# EAGLE design gacyagacya (EAGLE 9.6.2)
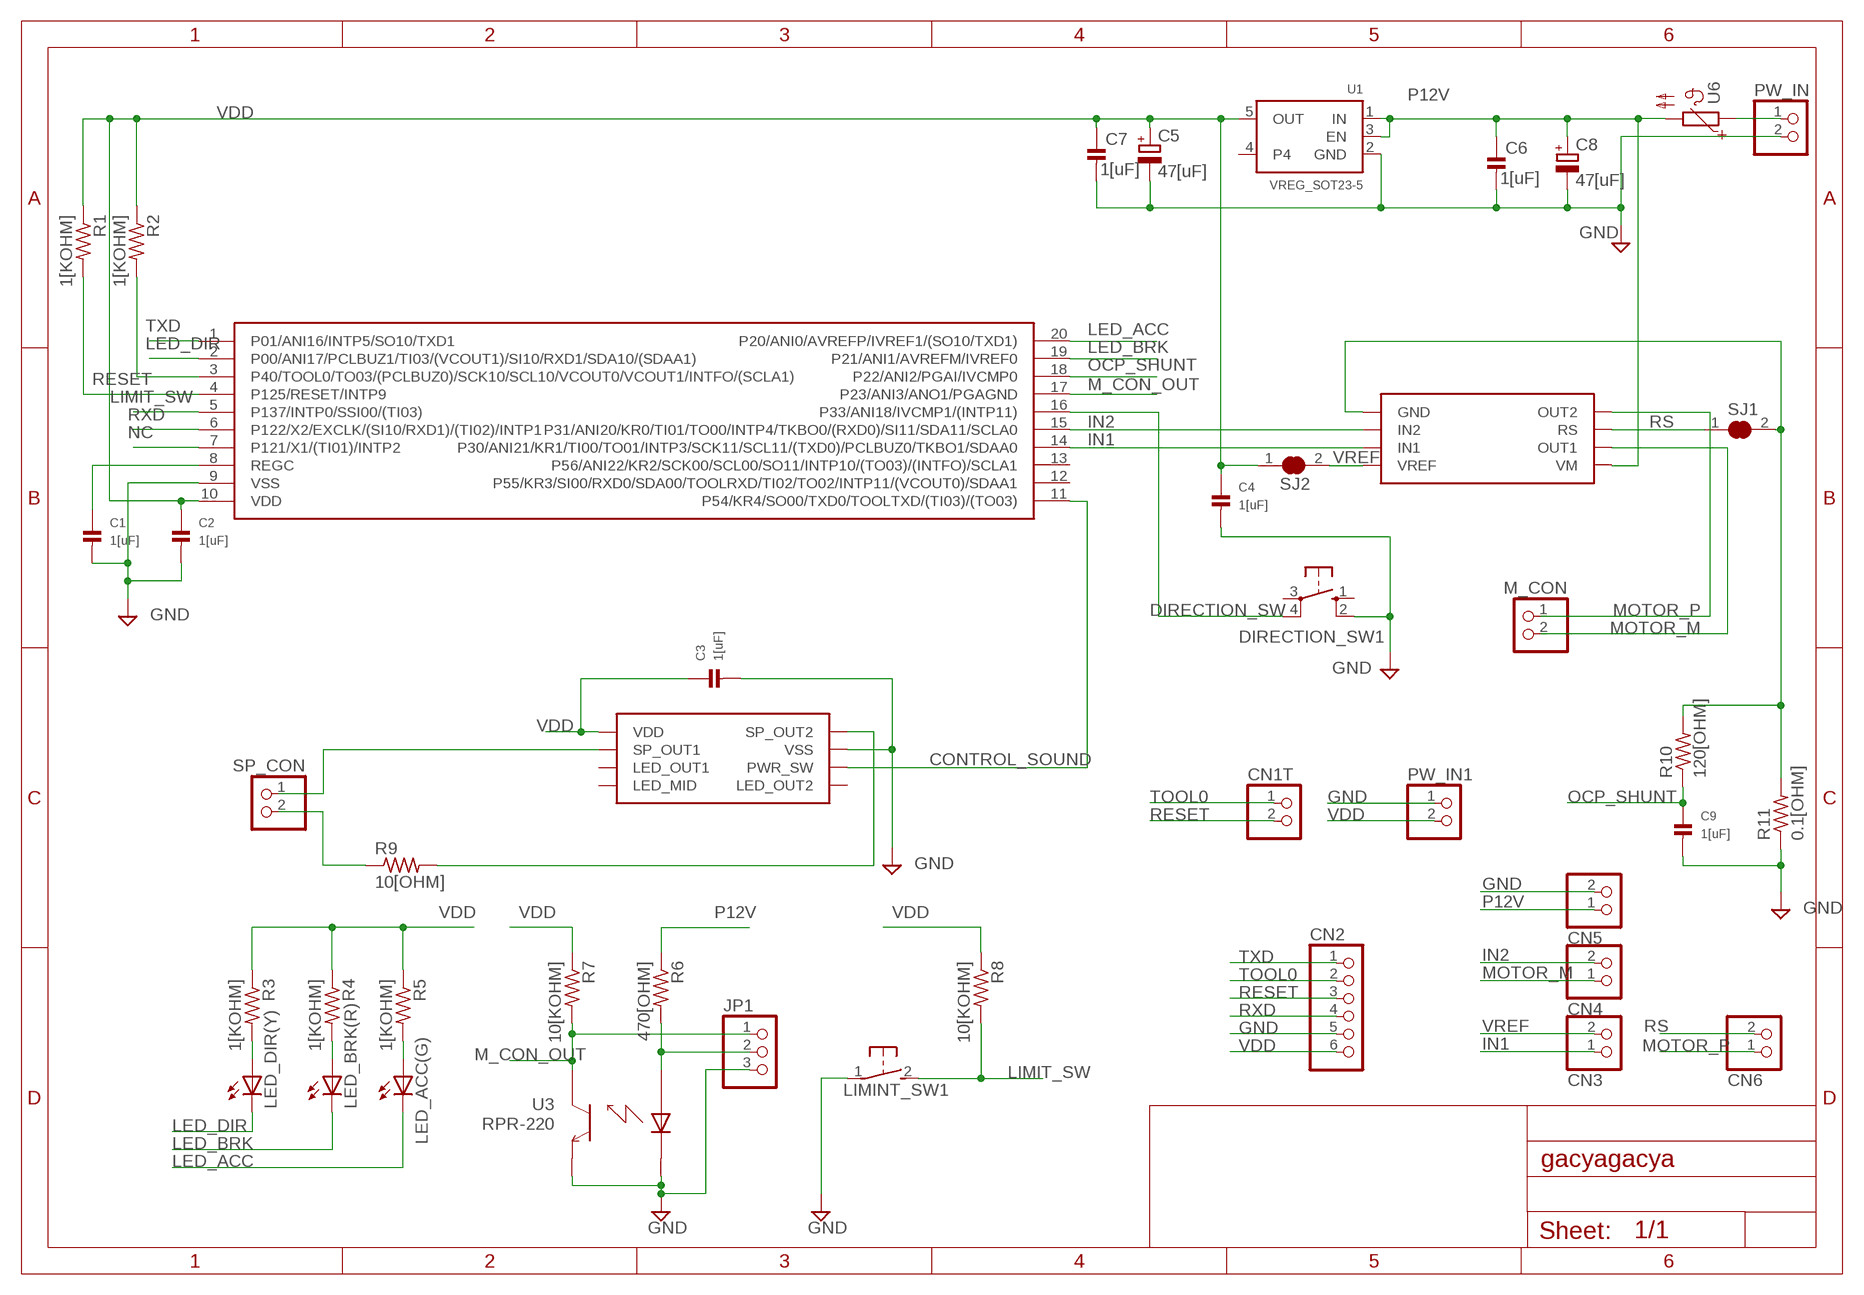
[diagram p0: schematic, sheet 1]

## Parts
C1  1[uF]  CAP_CERAMIC_0603  [_0603]
C2  1[uF]  CAP_CERAMIC_0603  [_0603]
C3  1[uF]  CAP_CERAMIC_0603  [_0603]
C4  1[uF]  CAP_CERAMIC_0603  [_0603]
C5  47[uF]  CPOL-EUE1.8-4  [E1,8-4]
C6  1[uF]  CAP_CERAMIC_0603  [_0603]
C7  1[uF]  CAP_CERAMIC_0603  [_0603]
C8  47[uF]  CPOL-EUE1.8-4  [E1,8-4]
C9  1[uF]  CAP_CERAMIC_0603  [_0603]
CN1T  HEADER-1X2ROUND  [1X02_ROUND]
CN2  XSR_6PIN  [XSR_6PIN]
CN3  HEADER-1X2ROUND  [1X02_ROUND]
CN4  HEADER-1X2ROUND  [1X02_ROUND]
CN5  HEADER-1X2ROUND  [1X02_ROUND]
CN6  HEADER-1X2ROUND  [1X02_ROUND]
DIRECTION_SW1  10-XXSMD_TACT_SW  [SMD_TACT_SW]
JP1  HEADER-1X3ROUND  [1X03_ROUND]
LED_ACC(G)  LED3MM  [LED3MM]
LED_BRK(R)  LED3MM  [LED3MM]
LED_DIR(Y)  LED3MM  [LED3MM]
LIMINT_SW1  31-XX  [B3F-31XX]
M_CON  HEADER-1X2ROUND  [1X02_ROUND]
PW_IN  HEADER-1X2ROUND  [1X02_ROUND]
PW_IN1  HEADER-1X2ROUND  [1X02_ROUND]
R1  1[KOHM]  R-US_R0603  [R0603]
R2  1[KOHM]  R-US_R0603  [R0603]
R3  1[KOHM]  R-US_R0603  [R0603]
R4  1[KOHM]  R-US_R0603  [R0603]
R5  1[KOHM]  R-US_R0603  [R0603]
R6  470[OHM]  R-US_R0603  [R0603]
R7  10[KOHM]  R-US_R0603  [R0603]
R8  10[KOHM]  R-US_R0603  [R0603]
R9  10[OHM]  R-US_R0603  [R0603]
R10  120[OHM]  R-US_R0603  [R0603]
R11  0.1[OHM]  R-US_R0603  [R0603]
SJ1  SOLDERJUMPER_CLOSEDPERM  [SOLDERJUMPER_CLOSEDPERM]
SJ2  SOLDERJUMPER_CLOSEDPERM  [SOLDERJUMPER_CLOSEDPERM]
SP_CON  HEADER-1X2ROUND  [1X02_ROUND]
U1  VREG_SOT23-5  [SOT23-5]
U2  RL78/G11_SSOP20  [SSOP20_225MIL]
U3  RPR-220  [RPR-220_FOOT_PRINT]
U4  TB67H450FNG  [SOP8]
U5  SOUND_IC_FOR_TETSUKON_GACYA  [SOUND_IC_FOR_TETSUKON_GACYA]
U6  RESETTABLE-PTC-5MM  [DIP_5MM]

## Nets
CONTROL_SOUND: U2.11(P54/KR4/SO00/TXD0/TOOLTXD/(TI03)/(TO03)) U5.6(PWR_SW)
DIRECTION_SW: DIRECTION_SW1.4(P1) U2.16(P33/ANI18/IVCMP1/(INTP11))
DRIVEROUT: R10.2 R11.2 SJ1.2 U4.1(GND)
GND [GND]: C1.2 C2.2 C3.2 C4.2 C5.- C6.2 C7.2 C8.- C9.2 CN2.5 CN5.2 DIRECTION_SW1.2(S1) JP1.3 LIMINT_SW1.1(P) PW_IN1.1 PW_IN.2 R11.1 U1.2(GND) U2.9(VSS) U3.P$2 U3.P$3 U5.7(VSS)
IN1: CN3.1 U2.14(P30/ANI21/KR1/TI00/TO01/INTP3/SCK11/SCL11/(TXD0)/PCLBUZ0/TKBO1/SDAA0) U4.3(IN1)
IN2: CN4.2 U2.15(P31/ANI20/KR0/TI01/TO00/INTP4/TKBO0/(RXD0)/SI11/SDA11/SCLA0) U4.2(IN2)
LED_ACC: LED_ACC(G).K(C) U2.20(P20/ANI0/AVREFP/IVREF1/(SO10/TXD1))
LED_BRK: LED_BRK(R).K(C) U2.19(P21/ANI1/AVREFM/IVREF0)
LED_DIR: LED_DIR(Y).K(C) U2.2(P00/ANI17/PCLBUZ1/TI03/(VCOUT1)/SI10/RXD1/SDA10/(SDAA1))
LIMIT_SW: LIMINT_SW1.2(S) R8.2 U2.5(P137/INTP0/SSI00/(TI03))
M_CON_OUT [GND]: JP1.1 R7.2 U2.17(P23/ANI3/ANO1/PGAGND) U3.P$4
MOTOR_M [POWER]: CN4.1 M_CON.2 U4.6(OUT1)
MOTOR_P [POWER]: CN6.1 M_CON.1 U4.8(OUT2)
N$1: LED_DIR(Y).A R3.2
N$2: PW_IN.1 U6.1
N$3: LED_ACC(G).A R5.2
N$4: C1.1 U2.8(REGC)
N$7: R9.2 U5.8(SP_OUT2)
N$8: R9.1 SP_CON.2
N$9: LED_BRK(R).A R4.2
N$10: JP1.2 R6.2 U3.P$1
N$11: SP_CON.1 U5.2(SP_OUT1)
NC: U2.7(P121/X1/(TI01)/INTP2)
OCP_SHUNT: C9.1 R10.1 U2.18(P22/ANI2/PGAI/IVCMP0)
P12V: C6.1 C8.+ CN5.1 R6.1 U1.1(IN) U1.3(EN) U4.5(VM) U6.2
RESET: CN1T.2 CN2.3 R1.2 U2.4(P125/RESET/INTP9)
RS: CN6.2 SJ1.1 U4.7(RS)
RXD: CN2.4 U2.6(P122/X2/EXCLK/(SI10/RXD1)/(TI02)/INTP1)
TOOL0: CN1T.1 CN2.2 R2.2 U2.3(P40/TOOL0/TO03/(PCLBUZ0)/SCK10/SCL10/VCOUT0/VCOUT1/INTFO/(SCLA1))
TXD: CN2.1 U2.1(P01/ANI16/INTP5/SO10/TXD1)
VDD: C2.1 C3.1 C4.1 C5.+ C7.1 CN2.6 PW_IN1.2 R1.1 R2.1 R3.1 R4.1 R5.1 R7.1 R8.1 SJ2.1 U1.5(OUT) U2.10(VDD) U5.1(VDD)
VREF: CN3.2 SJ2.2 U4.4(VREF)
Unconnected: DIRECTION_SW1.1(S) DIRECTION_SW1.3(P) U1.4 U2.12(P55/KR3/SI00/RXD0/SDA00/TOOLRXD/TI02/TO02/INTP11/(VCOUT0)/SDAA1) U2.13(P56/ANI22/KR2/SCK00/SCL00/SO11/INTP10/(TO03)/(INTFO)/SCLA1) U5.3(LED_OUT1) U5.4(LED_MID) U5.5(LED_OUT2)

## Library data of the parts
C1-C4 C6 C7 C9 = microbuilder:CAP_CERAMIC: Ceramic Capacitors 0402 - 0402 Surface Mount Capacitors 16pF 50V 5% [Digikey: 445-4899-2-ND] 18pF 50V 5% [Digikey: 490-1281-2-ND] 22pF 50V 5% [Digikey: 490-1283-2-ND] 68pF 50V 5% [Digikey: 490-1289-2-ND] 0.1uF 10V 10% [Digikey: 490-1318-2-ND] 1.0uF 6.3V 10% [Digikey: 490-1320-2-ND] 0603 - 0603 Surface Mount Capacitors 16 pF 50V 5% [Digikey: 445-5051-2-ND] 22 pF 50V [Digikey: PCC220ACVTR-ND] 33 pF 50V 5% [Digikey: 490-1415-1-ND] 56pF 50V 5% [Digikey: 490-1421-1-ND] 220pF 50V 5% [Digikey: 445-1285-1-ND] 680 pF 50V 2200 pF 50V 5% C0G [Digikey: 445-1297-1-ND] 5600 pF 100V 5% X7R [Digikey: 478-3711-1-ND] 0.1 µF 25V 10% [Digikey: PCC2277TR-ND] 0.22 µF 16V 10% X7R [Digikey: 445-1318-1-ND] 1.0 µF 25V 10% [Digikey: 445-5146-2-ND] 0603 - RF Specific 3pF 250V +/-0.1pF RF [Digikey: 712-1347-1-ND] 18 pF 250V 5% [Digikey: 478-3505-1-ND or 712-1322-1-ND] 56 pF 250V 5% C0G RF [Digikey: 490-4867-1-ND] 68 pF 250V RF [Digikey: 490-4868-1-ND] 0805 - 0805 Surface Mount Capacitors 220 pF 250V 2% RF Ceramic Capacitor [Digikey: 712-1398-1-ND] 1000 pF 50V 2% NP0 Ceramic Capacitor [Digikey: 478-3760-1-ND] 0.1 µF 25V 10% Ceramic Capacitor [Digikey: PCC1828TR-ND] 1.0 µF 16V 10% Ceramic Capacitor[Digikey: 490-1691-2-ND] 10.0 µF 10V 10% Ceramic Capacitor[Digikey: 709-1228-1-ND] 10.0 uF 16V 10% Ceramic Capacitor [Digikey: 478-5165-2-ND] 47 uF 6.3V 20% Ceramic Capacitor [Digikey: 587-1779-1-ND or 399-5506-1-ND] 1206 - 1206 Surface Mount Capacitors 47uF 10V 20% Ceramic Capacitor [Digikey: 490-5528-1-ND or 399-5508-1-ND or 445-6010-1-ND] 100uF 6.3V -20%, +80% Y5V Ceramic Capacitor (Digikey: 490-4512-1-ND, Mouser: 81-GRM31CF50J107ZE1L)
C5 C8 = rcl:CPOL-EU: POLARIZED CAPACITOR, European symbol; SPICEPREFIX: C
CN1T CN3-CN6 M_CON PW_IN PW_IN1 SP_CON = microbuilder:HEADER-1X2: PIN HEADER
CN2 = yoshino_low_tech:XSR_6PIN
DIRECTION_SW1 = yoshino_low_tech:10-XX: SMD TACT SWITCH
JP1 = microbuilder:HEADER-1X3: PIN HEADER
LED_ACC(G) LED_BRK(R) LED_DIR(Y) = led:LED: LED OSRAM: - CHIPLED LG R971, LG N971, LY N971, LG Q971, LY Q971, LO R971, LY R971 LH N974, LH R974 LS Q976, LO Q976, LY Q976 LO Q996 - Hyper CHIPLED LW Q18S LB Q993, LB Q99A, LB R99A - SideLED LS A670, LO A670, LY A670, LG A670, LP A670 LB A673, LV A673, LT A673, LW A673 LH A674 LY A675 LS A676, LA A676, LO A676, LY A676, LW A676 LS A679, LY A679, LG A679 - Hyper Micro SIDELED® LS Y876, LA Y876, LO Y876, LY Y876 LT Y87S - SmartLED LW L88C, LW L88S LB L89C, LB L89S, LG L890 LS L89K, LO L89K, LY L89K LS L896, LA L896, LO L896, LY L896 - TOPLED LS T670, LO T670, LY T670, LG T670, LP T670 LSG T670, LSP T670, LSY T670, LOP T670, LYG T670 LG T671, LOG T671, LSG T671 LB T673, LV T673, LT T673, LW T673 LH T674 LS T676, LA T676, LO T676, LY T676, LB T676, LH T676, LSB T676, LW T676 LB T67C, LV T67C, LT T67C, LS T67K, LO T67K, LY T67K, LW E67C LS E67B, LA E67B, LO E67B, LY E67B, LB E67C, LV E67C, LT E67C LW T67C LS T679, LY T679, LG T679 LS T770, LO T770, LY T770, LG T770, LP T770 LB T773, LV T773, LT T773, LW T773 LH T774 LS E675, LA E675, LY E675, LS T675 LS T776, LA T776, LO T776, LY T776, LB T776 LHGB T686 LT T68C, LB T68C - Hyper Mini TOPLED® LB M676 - Mini TOPLED Santana® LG M470 LS M47K, LO M47K, LY M47K Source: http://www.osram.convergy.de LUXEON: - LUMILED® LXK2-PW12-R00, LXK2-PW12-S00, LXK2-PW14-U00, LXK2-PW14-V00 LXK2-PM12-R00, LXK2-PM12-S00, LXK2-PM14-U00 LXK2-PE12-Q00, LXK2-PE12-R00, LXK2-PE12-S00, LXK2-PE14-T00, LXK2-PE14-U00 LXK2-PB12-K00, LXK2-PB12-L00, LXK2-PB12-M00, LXK2-PB14-N00, LXK2-PB14-P00, LXK2-PB14-Q00 LXK2-PR12-L00, LXK2-PR12-M00, LXK2-PR14-Q00, LXK2-PR14-R00 LXK2-PD12-Q00, LXK2-PD12-R00, LXK2-PD12-S00 LXK2-PH12-R00, LXK2-PH12-S00 LXK2-PL12-P00, LXK2-PL12-Q00, LXK2-PL12-R00 Source: www.luxeon.com KINGBRIGHT: KA-3528ASYC Source: www.kingbright.com
LIMINT_SW1 = switch-omron:31-XX: OMRON SWITCH; MPN: B3F-3100; OC_FARNELL: 959704; OC_NEWARK: 36M3582
R1-R11 = resistor:R-US_: RESISTOR, American symbol
SJ1 SJ2 = microbuilder:SOLDERJUMPER_CLOSED: Solder Jumper - Closed These solder jumpers are closed by default CLOSEDWIRE - 10 mil trace between pads that can be cut and resoldered later CLOSEDPERM - 63 mil trace between pads for a permanent connection (used to 'bridge' two signals, a shameless hack for Eagle). Can double as a test point as well (no cream layer)
U1 = yoshino_low_tech:VREG_SOT23-5
U2 = yoshino_low_tech:RL78/G11_SSOP20
U3 = yoshino_low_tech:RPR-220
U4 = yoshino_low_tech:TB67H450FNG: VM max. 44V Iout max. 3.0A
U5 = yoshino_low_tech:SOUND_IC_FOR_TETSUKON_GACYA
U6 = yoshino_low_tech:RESETTABLE-PTC-5MM

## Net classes
1 VCC: width 0.254 mm
2 GND: width 0.254 mm
3 POWER: width 0.254 mm
4 OSC: width 0.254 mm

## Board
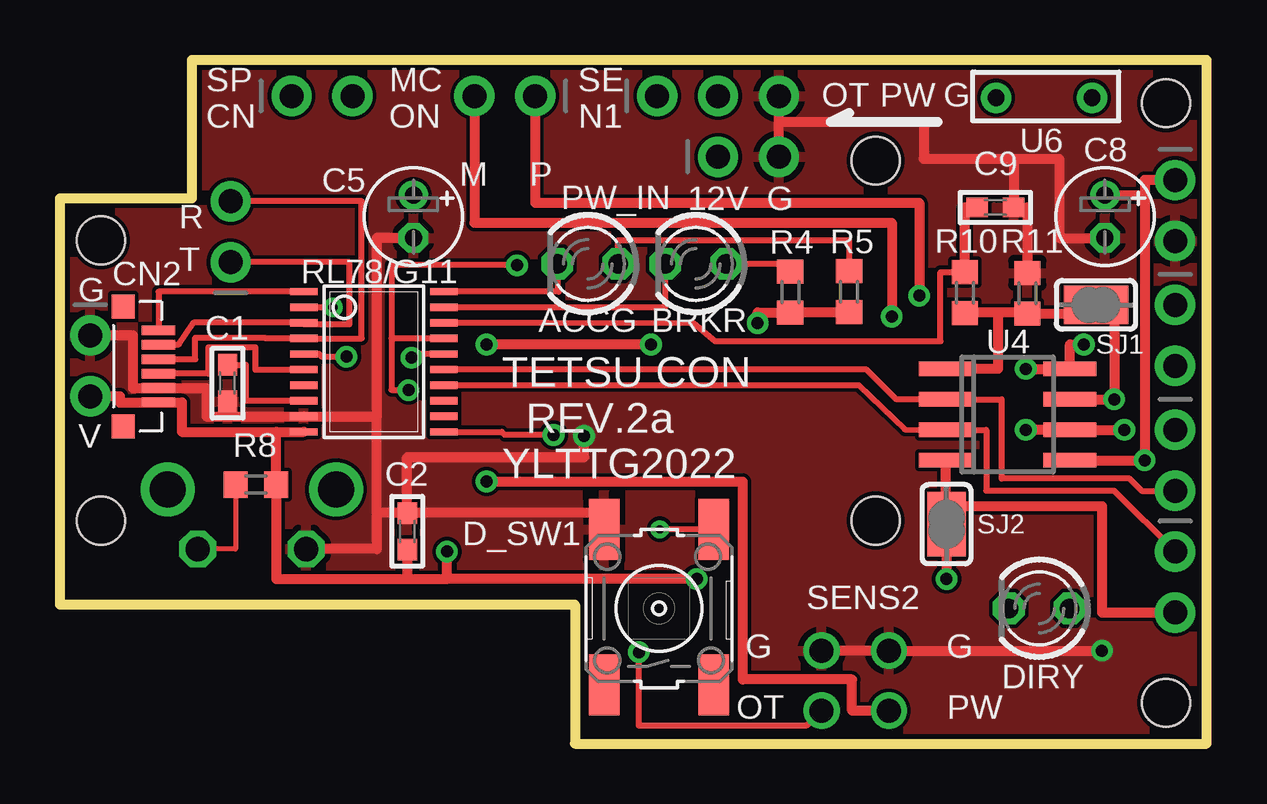
[diagram p1: board, top side]
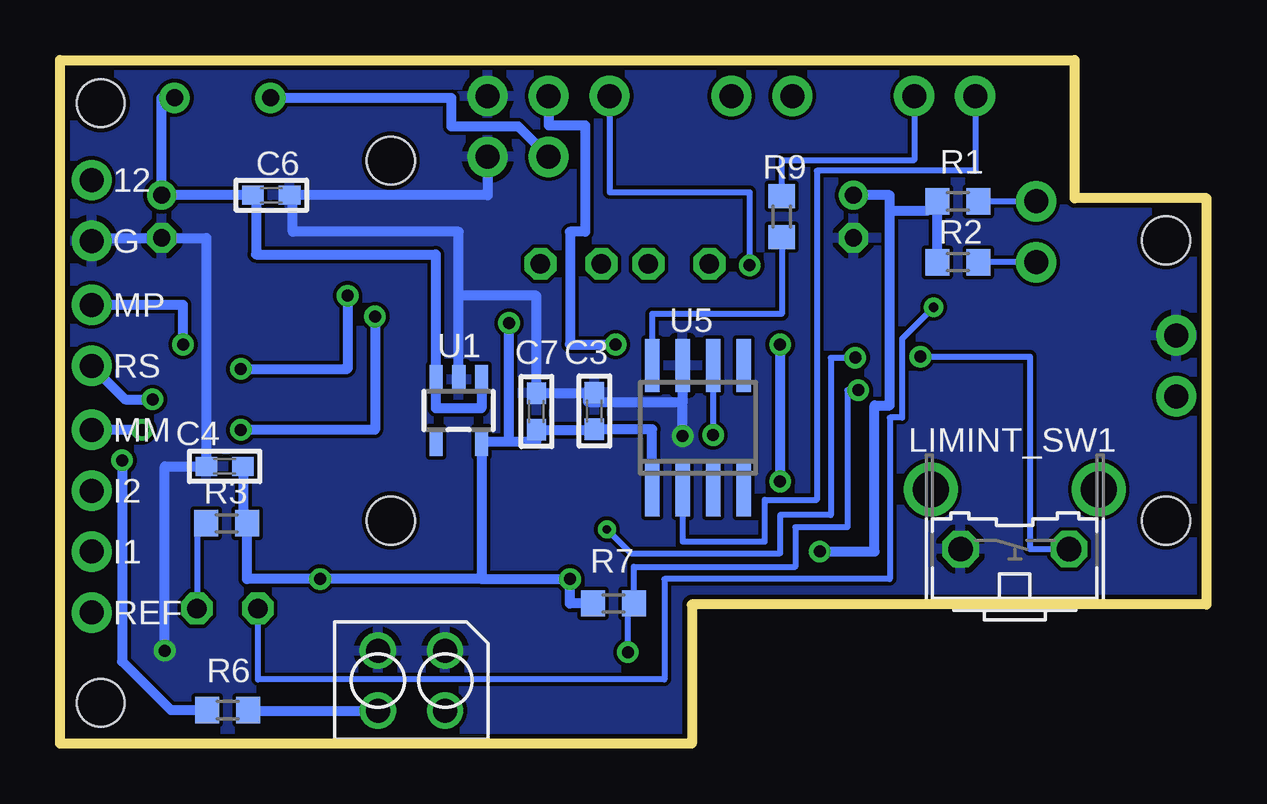
[diagram p2: board, bottom side, seen from below]

Size 47.8 x 28.5 mm. Coordinates in mm from the lower left corner, seen from the top.
Outline: 0,5.8 21.46,5.8 21.46,0 47.8,0 47.8,28.5 5.5,28.5 5.5,22.73 0,22.73 0,5.8
Copper layers (1*16): Top 0.035mm / dielectric 1.5mm / Bottom 0.035mm
Design rules "PCBGoGo": minimum track width 6mil, minimum drill 0.2mm, track to track 6mil, track to pad 6mil, pad to pad 6mil, via to via 6mil, smd to smd 6mil, copper to edge 0.2mm, drill to drill 6mil, minimum pad ring 10mil, minimum via ring 8mil, stop-mask expansion 4mil, vias tented up to drill 0mil, thermal gap 10mil
Holes 2 mm at 34,24.3 34,9.3 1.7,9.3 1.7,20.98 46.1,1.7 46.1,26.7

### Footprints (pad centres in the part's own frame; a part is rotated, then mirrored left to right if it is on the bottom)
_0603 = smd 0.9 x 0.8: 1 -0.762,0; 2 0.762,0
E1,8-4 = drill 0.711 pad 1.168: + -0.889,0 | drill 0.711 pad 1.168 octagon: - 0.889,0
1X02_ROUND = drill 1 pad 1.676: 1 -1.27,0; 2 1.27,0
XSR_6PIN = smd 0.4 x 1.4: 1 -1.501,-0.124; 2 -0.901,-0.124; 3 -0.301,-0.124; 4 0.299,-0.124; 5 0.899,-0.124; 6 1.499,-0.124 | smd 1 x 0.95: G1 -2.501,-1.599; G2 2.499,-1.599
SMD_TACT_SW = smd 2.54 x 1.27: 1 -3.175,2.286; 2 3.302,2.286; 3 -3.175,-2.286; 4 3.302,-2.286
1X03_ROUND = drill 1 pad 1.676: 1 -2.54,0; 2 0,0; 3 2.54,0
LED3MM = drill 0.813 octagon: A -1.27,0; K 1.27,0
B3F-31XX = drill 1.016 octagon: 1 -2.261,-1.245; 2 2.261,-1.245 | drill 1.499 pad 2.159: 3 -3.505,1.245; 4 3.505,1.245
R0603 = smd 1 x 1.1: 1 -0.85,0; 2 0.85,0
SOLDERJUMPER_CLOSEDPERM = smd 1.168 x 1.6: 1 -0.762,0; 2 0.762,0 | smd 0.635 x 1.6: WIRE 0,0
SOT23-5 = smd 0.55 x 1.2: 1 -0.95,-1.3; 2 0,-1.3; 3 0.95,-1.3; 4 0.95,1.3; 5 -0.95,1.3
SSOP20_225MIL = smd 0.305 x 1.15: 1 -2.925,-2.915; 2 -2.275,-2.915; 3 -1.625,-2.915; 4 -0.975,-2.915; 5 -0.325,-2.915; 6 0.325,-2.915; 7 0.975,-2.915; 8 1.625,-2.915; 9 2.275,-2.915; 10 2.925,-2.915; 11 2.925,2.915; 12 2.275,2.915; 13 1.625,2.915; 14 0.975,2.915; 15 0.325,2.915; 16 -0.325,2.915; 17 -0.975,2.915; 18 -1.625,2.915; 19 -2.275,2.915; 20 -2.925,2.915
RPR-220_FOOT_PRINT = drill 1: P$1 -1.4,-1.25; P$2 -1.4,1.25; P$3 1.4,1.25; P$4 1.4,-1.25
SOP8 = smd 0.6 x 2.2: 1 -1.905,-2.6; 2 -0.635,-2.6; 3 0.635,-2.6; 4 1.905,-2.6; 5 1.905,2.6; 6 0.635,2.6; 7 -0.635,2.6; 8 -1.905,2.6
SOUND_IC_FOR_TETSUKON_GACYA = smd 0.6 x 2.2: 1 -1.905,-2.6; 2 -0.635,-2.6; 3 0.635,-2.6; 4 1.905,-2.6; 5 1.905,2.6; 6 0.635,2.6; 7 -0.635,2.6; 8 -1.905,2.6
DIP_5MM = drill 0.7 pad 1.27: 1 -2,0; 2 2,0

### Placement (x,y rotation side)
C1  6.99,15.03 270 top
C2  14.48,8.85 90 top
C3  25.53,13.86 90 bottom
C4  40.94,11.56 180 bottom
C5  14.73,21.97 270 top
C6  38.99,22.86 0 bottom
C7  27.94,13.84 90 bottom
C8  43.56,21.97 270 top
C9  38.99,22.35 0 top
CN1T  7.11,21.34 90 top
CN2  4.23,15.72 270 top
CN3  46.48,6.73 270 top
CN4  46.48,11.81 270 top
CN5  46.48,22.23 270 top
CN6  46.48,17.02 270 top
DIRECTION_SW1  24.97,5.63 90 top
JP1  27.43,27 0 top
LED_ACC(G)  22,20 180 top
LED_BRK(R)  26.5,20 180 top
LED_DIR(Y)  40.82,5.63 180 top
LIMINT_SW1  8,9.36 0 bottom
M_CON  18.54,27 180 top
PW_IN  28.7,24.46 0 top
PW_IN1  1.27,15.75 270 top
R1  10.37,22.61 0 bottom
R2  10.37,20.07 0 bottom
R3  40.86,9.18 180 bottom
R4  30.44,18.82 90 top
R5  32.89,18.84 90 top
R6  40.81,1.4 0 bottom
R7  24.72,5.84 0 bottom
R8  8.17,10.79 180 top
R9  17.72,21.97 270 bottom
R10  37.72,18.8 270 top
R11  40.32,18.77 270 top
SJ1  43.18,18.29 180 top
SJ2  36.96,9.14 90 top
SP_CON  10.92,27 0 top
U1  31.18,13.88 180 bottom
U2  13.08,15.92 270 top
U3  33.15,2.62 0 bottom
U4  39.5,13.72 270 top
U5  21.21,13.17 0 bottom
U6  41.02,26.92 0 top

### Tracks (layer width: path | path; a pad name or v marks a point on that pad's centre or on a via)
CONTROL_SOUND  (via drill 0.5)
  Top 0.254: U2.11 18.41,12.99 18.54,12.87 v20.57,12.87
  Bottom 0.254: U5.6 v20.57,12.87
DIRECTION_SW  (via drill 0.35, 0.5)
  Top 0.254: U2.16 14.81,16.24 v14.65,16.09 | DIRECTION_SW1.4 v25.01,8.93 v25,8.93
  Bottom 0.254: v14.65,16.09 15.67,16.09 15.67,9.53 17.78,9.53 17.78,7.93 24,7.93 v25,8.93
DRIVEROUT
  Top 0.406: 39.1,17.97 40.31,17.97 R11.2 42.05,17.92 SJ1.2 | 39.1,17.97 39.1,15.62 U4.1 | 39.1,17.97 37.73,17.97 R10.2
GND  (via drill 0.5)
  Top 0.406: U3.P$3 U3.P$2 v43.43,3.88 v43.43,3.87 | 6.99,13.64 6.1,13.64 6.1,14.82 CN2.5 4.09,14.8 3.05,14.8 3.05,17.02 PW_IN1.1 | 6.99,13.64 U2.9 13.21,13.64 | 13.21,9.61 13.21,8.11 LIMINT_SW1.1 | C2.2 13.21,9.61 | C1.2 6.99,13.64 | C5.- 13.21,21.08 13.21,13.64 | C2.2 14.48,11.94 21.84,11.94 v21.84,12.83 | 13.21,9.61 13.21,13.64 | DIRECTION_SW1.2 22.69,9.61 C2.2 | C8.- 41.66,21.08 41.66,24.38 39.75,24.38 | JP1.3 PW_IN.2 29.97,25.86 30.02,25.91 36.01,25.91 36.01,24.38 39.75,24.38 | R11.1 40.32,22.35 C9.2 39.75,24.38
  Bottom 0.406: U1.2 31.18,18.67 | 31.18,18.67 31.18,21.34 38.1,21.34 38.1,22.86 C6.2 29.97,22.86 PW_IN.2 | 31.18,18.67 27.94,18.67 C7.2 25.78,14.61 | 25.78,14.61 25.53,14.61 C3.2 | U5.7 21.84,14.22 | 25.78,14.61 25.78,14.22 21.84,14.22 | v21.84,12.83 21.84,14.22 | v43.43,3.87 43.43,11.56 C4.2 41.7,21.08 C8.- 46.35,21.08 CN5.2
  pour Bottom: 47.8,0 21.46,0 21.46,5.8 0,5.8 0,22.73 5.5,22.73 5.5,28.5 47.8,28.5
  pour Top: 47.8,0 21.46,0 21.46,5.8 0,5.8 0,22.73 5.5,22.73 5.5,28.5 47.8,28.5
  pour Top: 47.8,0 21.46,0 21.46,5.8 0,5.8 0,22.73 5.5,22.73 5.5,28.5 47.8,28.5
IN1
  Top 0.254: U2.14 33.28,14.94 35.21,13.1 U4.3 38.61,13.08 38.61,10.54 43.94,10.54 CN3.1
IN2
  Top 0.254: U2.15 33.62,15.59 34.87,14.35 U4.2 39.24,14.35 39.24,11.05 44.58,11.05 45.09,10.54 CN4.2
LED_ACC
  Top 0.254: LED_ACC(G).K 20.73,18.89 20.78,18.84 U2.20
LED_BRK
  Top 0.254: LED_BRK(R).K 25.23,18.19 U2.19
LED_DIR  (via drill 0.4)
  Top 0.254: U2.2 v11.38,18.19
  Bottom 0.254: v11.38,18.19 12.7,16.87 12.7,13.59 13.21,13.59 13.21,6.86 22.61,6.86 22.61,2.67 39.55,2.67 LED_DIR(Y).K
LIMIT_SW  (via drill 0.5)
  Top 0.2: R8.2 7.32,8.11 LIMINT_SW1.2
  Top 0.254: U2.5 10.8,16.24 10.93,16.11 11.92,16.11 v11.94,16.13
  Bottom 0.254: v11.94,16.13 7.37,16.13 7.37,8.11 LIMINT_SW1.2
M_CON_OUT  (via drill 0.5)
  Top 0.254: U2.17 13.82,16.89 | 13.82,16.89 13.82,14.74 14.53,14.74 v14.53,14.73 | U3.P$4 31.11,0.74 24.13,0.74 v24.13,3.81 | v19.05,19.94 13.82,19.94 13.82,16.89
  Bottom 0.254: v14.53,14.73 14.99,14.73 14.99,9.02 17.14,9.02 17.14,7.37 23.88,7.37 R7.2 | R7.2 | R7.2 24.13,5.84 v24.13,3.81 | JP1.1 24.89,22.99 19.05,22.99 v19.05,19.94
MOTOR_M  (via drill 0.5)
  Top 0.406: M_CON.2 17.27,21.72 34.67,21.72 v34.67,17.8 | v40.26,13.08 U4.6 v44.37,13.08
  Bottom 0.406: v34.67,17.8 34.67,13.08 v40.26,13.08 | v44.37,13.08 CN4.1
MOTOR_P  (via drill 0.5)
  Top 0.406: M_CON.1 19.81,22.54 35.81,22.54 v35.81,18.67 | v40.26,15.62 U4.8 42.1,16.64 v42.67,16.64
  Bottom 0.406: v40.26,15.62 35.81,15.62 v35.81,18.67 | v42.67,16.64 42.67,18.29 CN6.1
N$1
  Bottom 0.254: R3.2 42.09,9.18 LED_DIR(Y).A
N$2
  Bottom 0.406: U6.1 31.5,26.92 31.5,25.73 28.7,25.73 PW_IN.1
N$3
  Top 0.254: LED_ACC(G).A 23.27,20.98 32.89,20.98 R5.2
N$4
  Top 0.254: C1.1 7.75,15.79 7.75,14.29 U2.8
N$7
  Bottom 0.254: R9.2 17.72,17.91 23.11,17.91 U5.8
N$8
  Bottom 0.254: R9.1 17.72,24.32 12.19,24.32 SP_CON.2
N$9
  Top 0.254: R4.2 30.44,20 LED_BRK(R).A
N$10  (via drill 0.5)
  Top 0.406: v24.64,16.64 v17.78,16.64 | v17.78,10.92 28.45,10.92 28.45,2.67 33.02,2.67 33.02,1.38 U3.P$1
  Bottom 0.406: JP1.2 27.43,25.78 25.91,25.78 25.91,21.34 26.54,21.34 26.54,16.64 v24.64,16.64 | v17.78,16.64 v17.78,10.92 | R6.2 39.88,1.4 39.88,1.38 U3.P$1
N$11
  Bottom 0.254: SP_CON.1 9.65,23.88 16.26,23.88 16.26,10.16 18.41,10.16 18.41,8.43 21.84,8.43 U5.2
OCP_SHUNT
  Top 0.254: U2.18 20.36,17.54 26.29,17.53 26.42,17.53 27.31,16.78 36.7,16.78 36.7,19.65 R10.1
  Top 0.406: R10.1 37.72,22.35 C9.1
P12V  (via drill 0.5)
  Top 0.406: U4.5 v45.21,11.81 45.21,22.86 | C8.+ 45.21,22.86 | CN5.1 45.21,23.5 45.21,22.86
  Bottom 0.406: U1.1 30.23,13.97 32.13,13.97 U1.3 32.13,20.39 39.62,20.39 39.62,22.73 C6.1 C8.+ 43.56,26.92 U6.2 | v45.21,11.81 45.21,3.43 43.18,1.4 R6.1
RESET
  Top 0.254: CN2.3 5.64,16.02 5.64,16.93 8.56,16.93 8.56,16.89 U2.4 12.57,16.89 12.57,22.61 CN1T.2
  Bottom 0.254: R1.2 CN1T.2
RS  (via drill 0.5)
  Top 0.406: U4.7 v43.94,14.35 SJ1.1
  Bottom 0.406: CN6.2 45.09,14.35 v43.94,14.35
RXD
  Top 0.254: U2.6 8.15,15.59 8.15,16.52 6.18,16.52 6.18,15.42 CN2.4
TOOL0
  Top 0.254: CN2.2 4.11,16.64 4.95,16.64 5.57,17.54 U2.3 10.17,17.48 12.06,17.48 12.06,20.07 CN1T.1
  Bottom 0.254: CN1T.1 R2.2
TXD
  Top 0.254: U2.1 4.11,18.84 CN2.1
VDD  (via drill 0.5)
  Top 0.406: 9.02,12.99 5.08,12.99 5.08,14.22 CN2.6 4.08,14.2 2.49,14.2 2.49,14.48 PW_IN1.2 | 9.02,12.99 U2.10 | v26.54,6.86 16.13,6.86 | 14.48,6.86 16.13,6.86 | 16.13,6.86 v16.13,8 | C2.1 14.48,6.86 | v29.08,17.53 29.08,17.97 R4.1 30.44,17.99 R5.1 | 14.48,6.86 9.02,6.86 R8.1 9.02,12.99 | SJ2.1 v36.96,6.86
  Bottom 0.406: 30.23,6.86 v26.54,6.86 26.54,5.84 R7.1 | v16.13,8 13.84,8 13.84,14.1 13.21,14.1 13.21,22.23 | C5.+ 13.21,22.86 13.21,22.23 | R2.1 11.29,20.13 11.22,20.19 R1.1 11.6,22.23 13.21,22.23 | 29.08,12.59 U1.5 30.23,6.86 | 29.08,12.59 27.94,12.59 C7.1 25.53,13.08 C3.1 23.11,13.1 U5.1 | 30.23,6.86 v36.96,6.86 40.01,6.86 R3.1 40.17,9.35 C4.1 | 29.08,12.59 v29.08,17.53
VREF
  Top 0.406: U4.4 36.9,9.91 SJ2.2 43.43,9.91 43.43,5.46 CN3.2

### Text on the board
tNames: OT | PW | G | SP / CN | MC / ON | SE / N1 | M | P | 12V | G | R | T | RL78/G11 | G | ACCG | BRKR | V | TETSU CON / REV.2a / YLTTG2022 | D_SW1 | SENS2 | G | G | DIRY | OT | PW
bNames: 12 | G | MP | RS | MM | I2 | I1 | REF